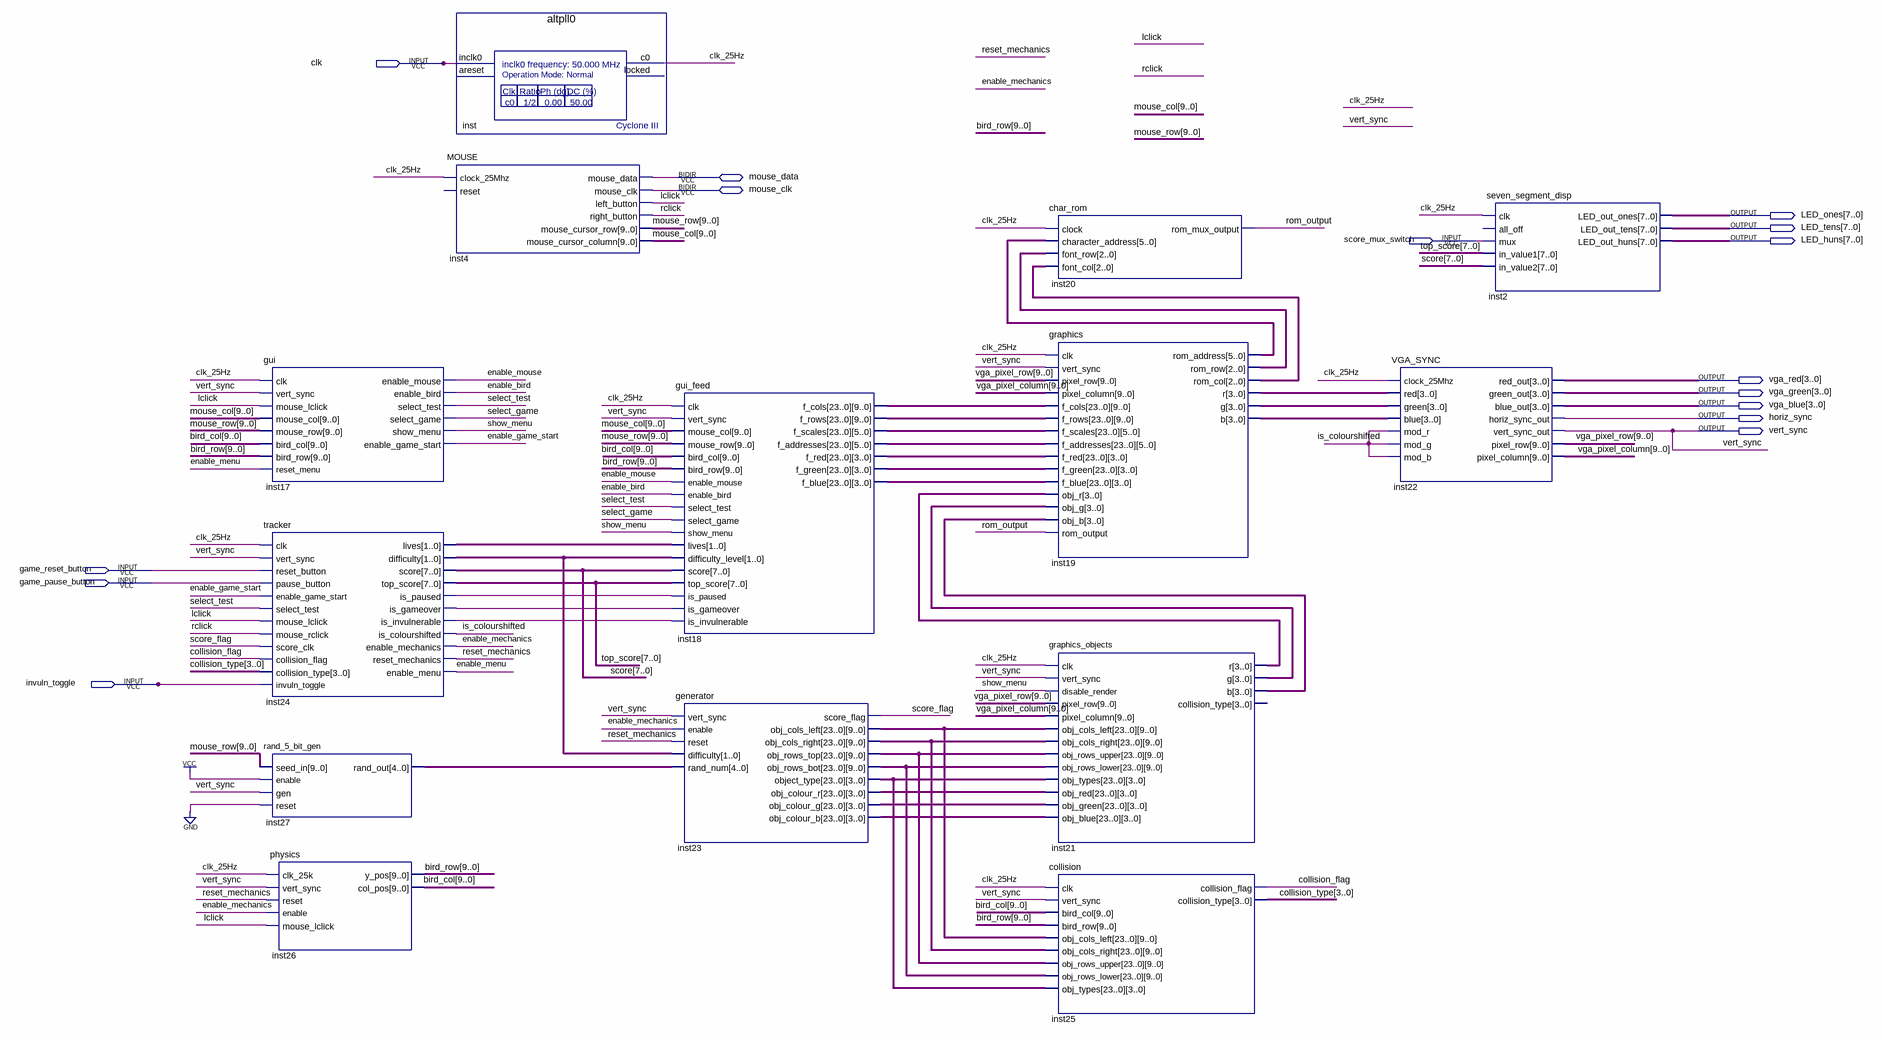
[diagram p0: schematic sheet]
// Quartus schematic main.bdf as structural Verilog: 14 symbols, 15 pins
module main (
  input  clk,
  input  score_mux_switch,
  input  game_reset_button,
  input  game_pause_button,
  input  invuln_toggle,
  inout  mouse_data,
  inout  mouse_clk,
  output [7:0] LED_ones,
  output [7:0] LED_tens,
  output [7:0] LED_huns,
  output [3:0] vga_red,
  output [3:0] vga_green,
  output [3:0] vga_blue,
  output horiz_sync,
  output vert_sync
);

  wire clk_25Hz, collision_flag, enable_bird, enable_game_start, enable_mechanics, enable_menu, enable_mouse,
       inst24_is_gameover, inst24_is_invulnerable, inst24_is_paused, is_colourshifted, lclick, rclick,
       reset_mechanics, rom_output, score_flag, select_game, select_test, show_menu;
  wire [1:0] inst24_difficulty, inst24_lives;
  wire [2:0] inst19_rom_col, inst19_rom_row;
  wire [3:0] collision_type, inst19_b, inst19_g, inst19_r, inst21_b, inst21_g, inst21_r;
  wire [4:0] inst27_rand_out;
  wire [5:0] inst19_rom_address;
  wire [7:0] score, top_score;
  wire [9:0] bird_col, bird_row, mouse_col, mouse_row, vga_pixel_column, vga_pixel_row;
  wire [95:0] inst18_f_blue, inst18_f_green, inst18_f_red, inst23_obj_colour_b, inst23_obj_colour_g,
       inst23_obj_colour_r, inst23_object_type;
  wire [143:0] inst18_f_addresses, inst18_f_scales;
  wire [239:0] inst18_f_cols, inst18_f_rows, inst23_obj_cols_left, inst23_obj_cols_right,
       inst23_obj_rows_bot, inst23_obj_rows_top;

  gui inst17 (
    .clk(clk_25Hz), .vert_sync(vert_sync), .mouse_lclick(lclick), .mouse_col(mouse_col),
    .mouse_row(mouse_row), .bird_col(bird_col), .bird_row(bird_row), .reset_menu(enable_menu),
    .enable_mouse(enable_mouse), .enable_bird(enable_bird), .select_test(select_test),
    .select_game(select_game), .show_menu(show_menu), .enable_game_start(enable_game_start));
  tracker inst24 (
    .clk(clk_25Hz), .vert_sync(vert_sync), .reset_button(game_reset_button),
    .pause_button(game_pause_button), .enable_game_start(enable_game_start), .select_test(select_test),
    .mouse_lclick(lclick), .mouse_rclick(rclick), .score_clk(score_flag), .collision_flag(collision_flag),
    .collision_type(collision_type), .invuln_toggle(invuln_toggle), .lives(inst24_lives),
    .difficulty(inst24_difficulty), .score(score), .top_score(top_score), .is_paused(inst24_is_paused),
    .is_gameover(inst24_is_gameover), .is_invulnerable(inst24_is_invulnerable),
    .is_colourshifted(is_colourshifted), .enable_mechanics(enable_mechanics),
    .reset_mechanics(reset_mechanics), .enable_menu(enable_menu));
  rand_5_bit_gen inst27 (.seed_in(mouse_row), .enable(1'b1), .gen(vert_sync), .reset(1'b0), .rand_out(inst27_rand_out));
  physics inst26 (
    .clk_25k(clk_25Hz), .vert_sync(vert_sync), .reset(reset_mechanics), .enable(enable_mechanics),
    .mouse_lclick(lclick), .y_pos(bird_row), .col_pos(bird_col));
  altpll0 inst (.inclk0(clk), .c0(clk_25Hz));  // open: areset, locked
  MOUSE inst4 (
    .clock_25Mhz(clk_25Hz), .left_button(lclick), .right_button(rclick), .mouse_cursor_row(mouse_row),
    .mouse_cursor_column(mouse_col), .mouse_data(mouse_data), .mouse_clk(mouse_clk));  // open: reset
  gui_feed inst18 (
    .clk(clk_25Hz), .vert_sync(vert_sync), .mouse_col(mouse_col), .mouse_row(mouse_row), .bird_col(bird_col),
    .bird_row(bird_row), .enable_mouse(enable_mouse), .enable_bird(enable_bird), .select_test(select_test),
    .select_game(select_game), .show_menu(show_menu), .lives(inst24_lives),
    .difficulty_level(inst24_difficulty), .score(score), .top_score(top_score), .is_paused(inst24_is_paused),
    .is_gameover(inst24_is_gameover), .is_invulnerable(inst24_is_invulnerable), .f_cols(inst18_f_cols),
    .f_rows(inst18_f_rows), .f_scales(inst18_f_scales), .f_addresses(inst18_f_addresses),
    .f_red(inst18_f_red), .f_green(inst18_f_green), .f_blue(inst18_f_blue));
  generator inst23 (
    .vert_sync(vert_sync), .enable(enable_mechanics), .reset(reset_mechanics),
    .difficulty(inst24_difficulty), .rand_num(inst27_rand_out), .score_flag(score_flag),
    .obj_cols_left(inst23_obj_cols_left), .obj_cols_right(inst23_obj_cols_right),
    .obj_rows_top(inst23_obj_rows_top), .obj_rows_bot(inst23_obj_rows_bot), .object_type(inst23_object_type),
    .obj_colour_r(inst23_obj_colour_r), .obj_colour_g(inst23_obj_colour_g), .obj_colour_b(inst23_obj_colour_b));
  char_rom inst20 (
    .clock(clk_25Hz), .character_address(inst19_rom_address), .font_row(inst19_rom_row),
    .font_col(inst19_rom_col), .rom_mux_output(rom_output));
  graphics inst19 (
    .clk(clk_25Hz), .vert_sync(vert_sync), .pixel_row(vga_pixel_row), .pixel_column(vga_pixel_column),
    .f_cols(inst18_f_cols), .f_rows(inst18_f_rows), .f_scales(inst18_f_scales),
    .f_addresses(inst18_f_addresses), .f_red(inst18_f_red), .f_green(inst18_f_green), .f_blue(inst18_f_blue),
    .obj_r(inst21_r), .obj_g(inst21_g), .obj_b(inst21_b), .rom_output(rom_output),
    .rom_address(inst19_rom_address), .rom_row(inst19_rom_row), .rom_col(inst19_rom_col), .r(inst19_r),
    .g(inst19_g), .b(inst19_b));
  graphics_objects inst21 (
    .clk(clk_25Hz), .vert_sync(vert_sync), .disable_render(show_menu), .pixel_row(vga_pixel_row),
    .pixel_column(vga_pixel_column), .obj_cols_left(inst23_obj_cols_left),
    .obj_cols_right(inst23_obj_cols_right), .obj_rows_upper(inst23_obj_rows_top),
    .obj_rows_lower(inst23_obj_rows_bot), .obj_types(inst23_object_type), .obj_red(inst23_obj_colour_r),
    .obj_green(inst23_obj_colour_g), .obj_blue(inst23_obj_colour_b), .r(inst21_r), .g(inst21_g), .b(inst21_b));  // open: collision_type
  collision inst25 (
    .clk(clk_25Hz), .vert_sync(vert_sync), .bird_col(bird_col), .bird_row(bird_row),
    .obj_cols_left(inst23_obj_cols_left), .obj_cols_right(inst23_obj_cols_right),
    .obj_rows_upper(inst23_obj_rows_top), .obj_rows_lower(inst23_obj_rows_bot),
    .obj_types(inst23_object_type), .collision_flag(collision_flag), .collision_type(collision_type));
  VGA_SYNC inst22 (
    .clock_25Mhz(clk_25Hz), .red(inst19_r), .green(inst19_g), .blue(inst19_b), .mod_r(is_colourshifted),
    .mod_g(is_colourshifted), .mod_b(is_colourshifted), .red_out(vga_red), .green_out(vga_green),
    .blue_out(vga_blue), .horiz_sync_out(horiz_sync), .vert_sync_out(vert_sync), .pixel_row(vga_pixel_row),
    .pixel_column(vga_pixel_column));
  seven_segment_disp inst2 (
    .clk(clk_25Hz), .mux(score_mux_switch), .in_value1(top_score), .in_value2(score),
    .LED_out_ones(LED_ones), .LED_out_tens(LED_tens), .LED_out_huns(LED_huns));  // open: all_off
endmodule
